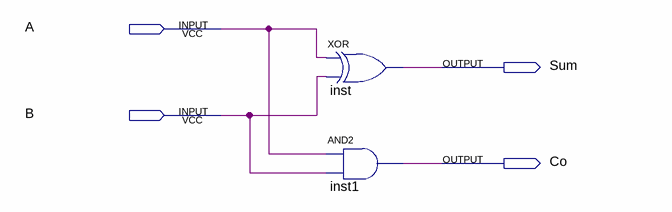
[diagram p0: schematic sheet]
// Quartus schematic q1103.bdf as structural Verilog: 2 symbols, 4 pins
module q1103 (
  input  A,
  input  B,
  output Sum,
  output Co
);

  xor inst (Sum, A, B);
  and inst1 (Co, A, B);
endmodule
